# Altium schematic sheet Power.SchDoc
size 420 x 297 mm; DocumentNumber: 3; SheetNumber: 3; SheetTotal: 13; DecimalNumber: СНАБ.468222.001 ЭЗ
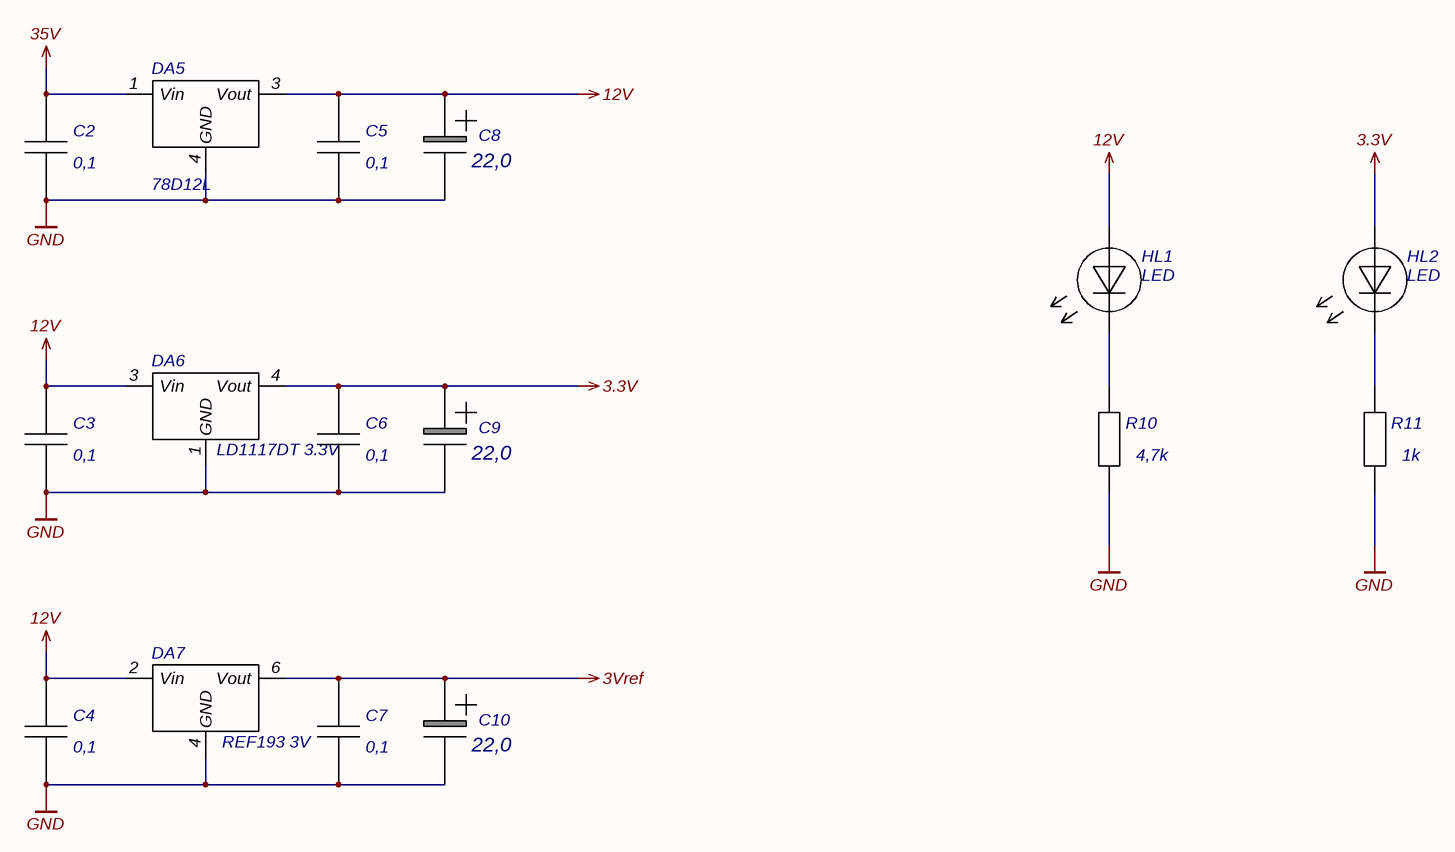
[diagram p0: Power.SchDoc]

## Parts
C2  0,1  [С0805]
C3  0,1  [С0805]
C4  0,1  [С0805]
C5  0,1  [С0805]
C6  0,1  [С0805]
C7  0,1  [С0805]
C8  22,0  [C_tant 3(С-type)]
C9  22,0  [C_tant 3(С-type)]
C10  22,0  [C_tant 3(С-type)]
DA5  78D12L  [DPAK]
DA6  LD1117DT 3.3V  [DPAK]
DA7  REF193 3V  [SOP-8 (SOIC)]
HL1  LED  [LED 5mm (L-7113IT)]
HL2  LED  [LED 5mm (L-7113IT)]
R10  4,7k  [R0603]
R11  1k  [R0603]

## Nets
3.3V: C6.2 C9.1 DA6.4(Vout) HL2.2(A)
3Vref: C7.2 C10.1 DA7.6(Vout)
12V: C3.2 C4.2 C5.2 C8.1 DA5.3(Vout) DA6.3(Vin) DA7.2(Vin) HL1.2(A)
35V: C2.2 DA5.1(Vin)
GND: C2.1 C3.1 C4.1 C5.1 C6.1 C7.1 C8.2 C9.2 C10.2 DA5.4(GND) DA6.1(GND) DA7.4(GND) R10.1 R11.1
NetHL1_1: HL1.1(K) R10.2
NetHL2_1: HL2.1(K) R11.2

## Notes on the sheet
- Подп. и дата
- Инв.№ дубл.
- Взам.инв.№
- Подп.и дата
- Инв.№ подл.
- Изм.
- Лист
- № докум.
- Подп.
- Дата
- Копировал
- Формат  A3

## Library data of the parts
C2-C7 = Chip Capasitor: Чип-конденсатор; Value: 0,1
C8-C10 = К53-67 (3/C): Чип конденсатор (3/C) тант.; Manufacturer: KEMET; Partnumber: Т491С226К010АТ; Case: C_tant 3(С-type); TU: -; Value: 22,0
DA5 = 78D12L: Стабилизатор напряжения, 12В; Manufacturer: UTD Semiconductor Co.,Ltd; Case: DPAK (TO-252); Name: 78D12L; TU: *; Datasheet: https://static.chipdip.ru/lib/619/DOC025619012.pdf
DA6 = LD1117DT33TR: LDO-регулятор напряжения, 3.3В; Manufacturer: STMicroelectronics; Case: DPAK; Name: LD1117DT33TR; Datasheet: https://static.chipdip.ru/lib/677/DOC011677089.pdf
DA7 = REF193: Источник опорного напряжения, 3В; Manufacturer: Analog Devices; Name: REF193GSZ-REEL; Case: SOP-8; Datasheet: https://static.chipdip.ru/lib/039/DOC012039028.pdf
HL1 HL2 = LED: Светодиод, d=5мм; Manufacturer: Kingbright; Name: L-7113IT; Case: L-7113IT; Datasheet: https://static.chipdip.ru/lib/771/DOC059771173.pdf
R10 R11 = Chip Resistor: Чип-резистор
  R10: Value: 4,7k
  R11: Value: 1k